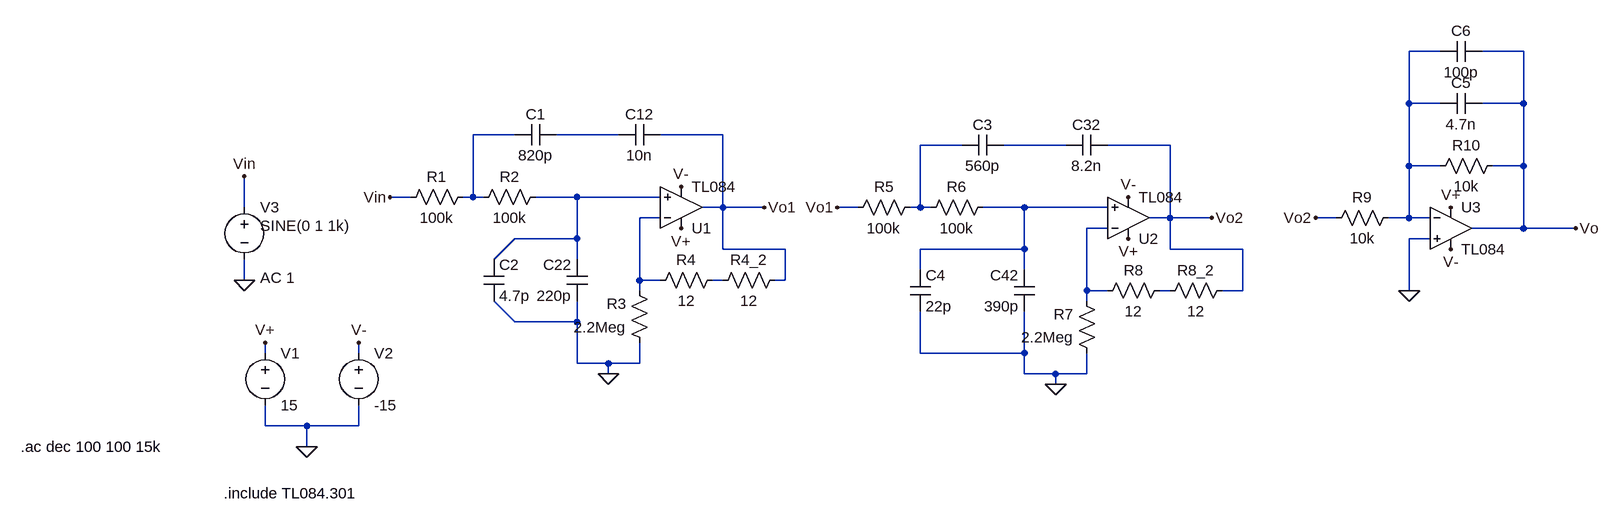
[diagram p0: schematic Bessel SIN tolerancias.asc]
Bessel SIN tolerancias.asc, the LTspice schematic file:
Version 4
SHEET 1 1536 680
WIRE 1280 -64 1232 -64
WIRE 1408 -64 1344 -64
WIRE 1232 16 1232 -64
WIRE 1280 16 1232 16
WIRE 1408 16 1408 -64
WIRE 1408 16 1344 16
WIRE -144 64 -208 64
WIRE 16 64 -80 64
WIRE 176 64 80 64
WIRE 544 80 480 80
WIRE 704 80 608 80
WIRE 864 80 768 80
WIRE 1232 112 1232 16
WIRE 1280 112 1232 112
WIRE 1408 112 1408 16
WIRE 1408 112 1360 112
WIRE -304 160 -336 160
WIRE -208 160 -208 64
WIRE -208 160 -224 160
WIRE -192 160 -208 160
WIRE -48 160 -112 160
WIRE 80 160 -48 160
WIRE -560 176 -560 128
WIRE 176 176 176 64
WIRE 176 176 144 176
WIRE 240 176 176 176
WIRE 384 176 352 176
WIRE 480 176 480 80
WIRE 480 176 464 176
WIRE 496 176 480 176
WIRE 640 176 576 176
WIRE 768 176 640 176
WIRE 80 192 48 192
WIRE 864 192 864 80
WIRE 864 192 832 192
WIRE 928 192 864 192
WIRE 1120 192 1088 192
WIRE 1232 192 1232 112
WIRE 1232 192 1200 192
WIRE 1264 192 1232 192
WIRE 768 208 736 208
WIRE 1408 208 1408 112
WIRE 1408 208 1328 208
WIRE 1488 208 1408 208
WIRE -48 224 -48 160
WIRE -48 224 -144 224
WIRE 1264 224 1232 224
WIRE 176 240 176 176
WIRE 272 240 176 240
WIRE 640 240 640 176
WIRE 640 240 480 240
WIRE 864 240 864 192
WIRE 976 240 864 240
WIRE -176 256 -144 224
WIRE -48 256 -48 224
WIRE 480 272 480 240
WIRE 640 272 640 240
WIRE -560 288 -560 256
WIRE 48 288 48 192
WIRE 80 288 48 288
WIRE 176 288 160 288
WIRE 272 288 272 240
WIRE 272 288 256 288
WIRE 48 304 48 288
WIRE 736 304 736 208
WIRE 768 304 736 304
WIRE 864 304 848 304
WIRE 976 304 976 240
WIRE 976 304 944 304
WIRE 1232 304 1232 224
WIRE 736 320 736 304
WIRE -144 352 -176 320
WIRE -48 352 -48 320
WIRE -48 352 -144 352
WIRE -528 400 -528 384
WIRE -384 400 -384 384
WIRE 480 400 480 336
WIRE 640 400 640 336
WIRE 640 400 480 400
WIRE -48 416 -48 352
WIRE 0 416 -48 416
WIRE 48 416 48 384
WIRE 48 416 0 416
WIRE 0 432 0 416
WIRE 640 432 640 400
WIRE 688 432 640 432
WIRE 736 432 736 400
WIRE 736 432 688 432
WIRE 688 448 688 432
WIRE -528 512 -528 480
WIRE -464 512 -528 512
WIRE -384 512 -384 480
WIRE -384 512 -464 512
WIRE -464 544 -464 512
FLAG 0 432 0
FLAG 112 208 V+
FLAG 1296 176 V+
FLAG 112 144 V-
FLAG 1296 240 V-
FLAG -336 160 Vin
FLAG 240 176 Vo1
FLAG 688 448 0
FLAG 800 224 V+
FLAG 800 160 V-
FLAG 352 176 Vo1
FLAG 928 192 Vo2
FLAG 1088 192 Vo2
FLAG 1232 304 0
FLAG 1488 208 Vo
FLAG -464 544 0
FLAG -528 384 V+
FLAG -384 384 V-
FLAG -560 288 0
FLAG -560 128 Vin
SYMBOL Opamps\\opamp2 112 240 M180
SYMATTR InstName U1
SYMATTR Value TL084
SYMBOL res -208 144 R90
WINDOW 0 0 56 VBottom 2
WINDOW 3 32 56 VTop 2
SYMATTR InstName R1
SYMATTR Value 100k
SYMBOL res -96 144 R90
WINDOW 0 0 56 VBottom 2
WINDOW 3 32 56 VTop 2
SYMATTR InstName R2
SYMATTR Value 100k
SYMBOL res 64 400 R180
WINDOW 0 36 76 Left 2
WINDOW 3 36 40 Left 2
SYMATTR InstName R3
SYMATTR Value 2.2Meg
SYMBOL res 64 304 R270
WINDOW 0 32 56 VTop 2
WINDOW 3 0 56 VBottom 2
SYMATTR InstName R4
SYMATTR Value 12
SYMBOL cap -80 48 R90
WINDOW 0 0 32 VBottom 2
WINDOW 3 32 32 VTop 2
SYMATTR InstName C1
SYMATTR Value 820p
SYMBOL cap -32 320 R180
WINDOW 0 24 56 Left 2
WINDOW 3 24 8 Left 2
SYMATTR InstName C22
SYMATTR Value 220p
SYMBOL Opamps\\opamp2 800 256 M180
SYMATTR InstName U2
SYMATTR Value TL084
SYMBOL res 480 160 R90
WINDOW 0 0 56 VBottom 2
WINDOW 3 32 56 VTop 2
SYMATTR InstName R5
SYMATTR Value 100k
SYMBOL res 592 160 R90
WINDOW 0 0 56 VBottom 2
WINDOW 3 32 56 VTop 2
SYMATTR InstName R6
SYMATTR Value 100k
SYMBOL res 752 416 R180
WINDOW 0 36 76 Left 2
WINDOW 3 36 40 Left 2
SYMATTR InstName R7
SYMATTR Value 2.2Meg
SYMBOL res 752 320 R270
WINDOW 0 32 56 VTop 2
WINDOW 3 0 56 VBottom 2
SYMATTR InstName R8
SYMATTR Value 12
SYMBOL cap 656 336 R180
WINDOW 0 24 56 Left 2
WINDOW 3 24 8 Left 2
SYMATTR InstName C42
SYMATTR Value 390p
SYMBOL res 1216 176 R90
WINDOW 0 0 56 VBottom 2
WINDOW 3 32 56 VTop 2
SYMATTR InstName R9
SYMATTR Value 10k
SYMBOL Opamps\\opamp2 1296 144 R0
SYMATTR InstName U3
SYMATTR Value TL084
SYMBOL cap 1344 0 R90
WINDOW 0 0 32 VBottom 2
WINDOW 3 32 32 VTop 2
SYMATTR InstName C5
SYMATTR Value 4.7n
SYMBOL res 1376 96 R90
WINDOW 0 0 56 VBottom 2
WINDOW 3 32 56 VTop 2
SYMATTR InstName R10
SYMATTR Value 10k
SYMBOL voltage -528 384 R0
WINDOW 123 0 0 Left 2
WINDOW 39 0 0 Left 2
SYMATTR InstName V1
SYMATTR Value 15
SYMBOL voltage -384 384 R0
WINDOW 123 0 0 Left 2
WINDOW 39 0 0 Left 2
SYMATTR InstName V2
SYMATTR Value -15
SYMBOL voltage -560 160 R0
WINDOW 123 24 124 Left 2
WINDOW 39 0 0 Left 2
WINDOW 3 24 44 Left 2
SYMATTR Value2 AC 1
SYMATTR Value SINE(0 1 1k)
SYMATTR InstName V3
SYMBOL cap -192 256 R0
SYMATTR InstName C2
SYMATTR Value 4.7p
SYMBOL cap 80 48 R90
WINDOW 0 0 32 VBottom 2
WINDOW 3 32 32 VTop 2
SYMATTR InstName C12
SYMATTR Value 10n
SYMBOL cap 608 64 R90
WINDOW 0 0 32 VBottom 2
WINDOW 3 32 32 VTop 2
SYMATTR InstName C3
SYMATTR Value 560p
SYMBOL cap 768 64 R90
WINDOW 0 0 32 VBottom 2
WINDOW 3 32 32 VTop 2
SYMATTR InstName C32
SYMATTR Value 8.2n
SYMBOL cap 464 272 R0
SYMATTR InstName C4
SYMATTR Value 22p
SYMBOL cap 1344 -80 R90
WINDOW 0 0 32 VBottom 2
WINDOW 3 32 32 VTop 2
SYMATTR InstName C6
SYMATTR Value 100p
SYMBOL res 272 272 R90
WINDOW 0 0 56 VBottom 2
WINDOW 3 32 56 VTop 2
SYMATTR InstName R4_2
SYMATTR Value 12
SYMBOL res 960 288 R90
WINDOW 0 0 56 VBottom 2
WINDOW 3 32 56 VTop 2
SYMATTR InstName R8_2
SYMATTR Value 12
TEXT -592 616 Left 2 !.include TL084.301
TEXT -904 544 Left 2 !.ac dec 100 100 15k

The netlist it stands for:
* Bessel SIN tolerancias.asc
XU1 N006 N008 V+ V- Vo1 TL084  ; pins In+ In- V+ V- OUT
R1 N002 Vin 100k
R2 N006 N002 100k
R3 0 N008 2.2Meg
R4 N008 N010 12
C1 N003 N002 820p
C22 0 N006 220p
XU2 N007 N009 V+ V- Vo2 TL084  ; pins In+ In- V+ V- OUT
R5 N004 Vo1 100k
R6 N007 N004 100k
R7 0 N009 2.2Meg
R8 N009 N011 12
C42 0 N007 390p
R9 N001 Vo2 10k
XU3 0 N001 V+ V- Vo TL084  ; pins In+ In- V+ V- OUT
C5 Vo N001 4.7n
R10 Vo N001 10k
V1 V+ 0 15
V2 V- 0 -15
V3 Vin 0 SINE(0 1 1k) AC 1
C2 N006 0 4.7p
C12 Vo1 N003 10n
C3 N005 N004 560p
C32 Vo2 N005 8.2n
C4 N007 0 22p
C6 Vo N001 100p
R4_2 Vo1 N010 12
R8_2 Vo2 N011 12
.include TL084.301
.ac dec 100 100 15k
.backanno
.end